# EAGLE design mini64se-F103-R6 (EAGLE 6.4)
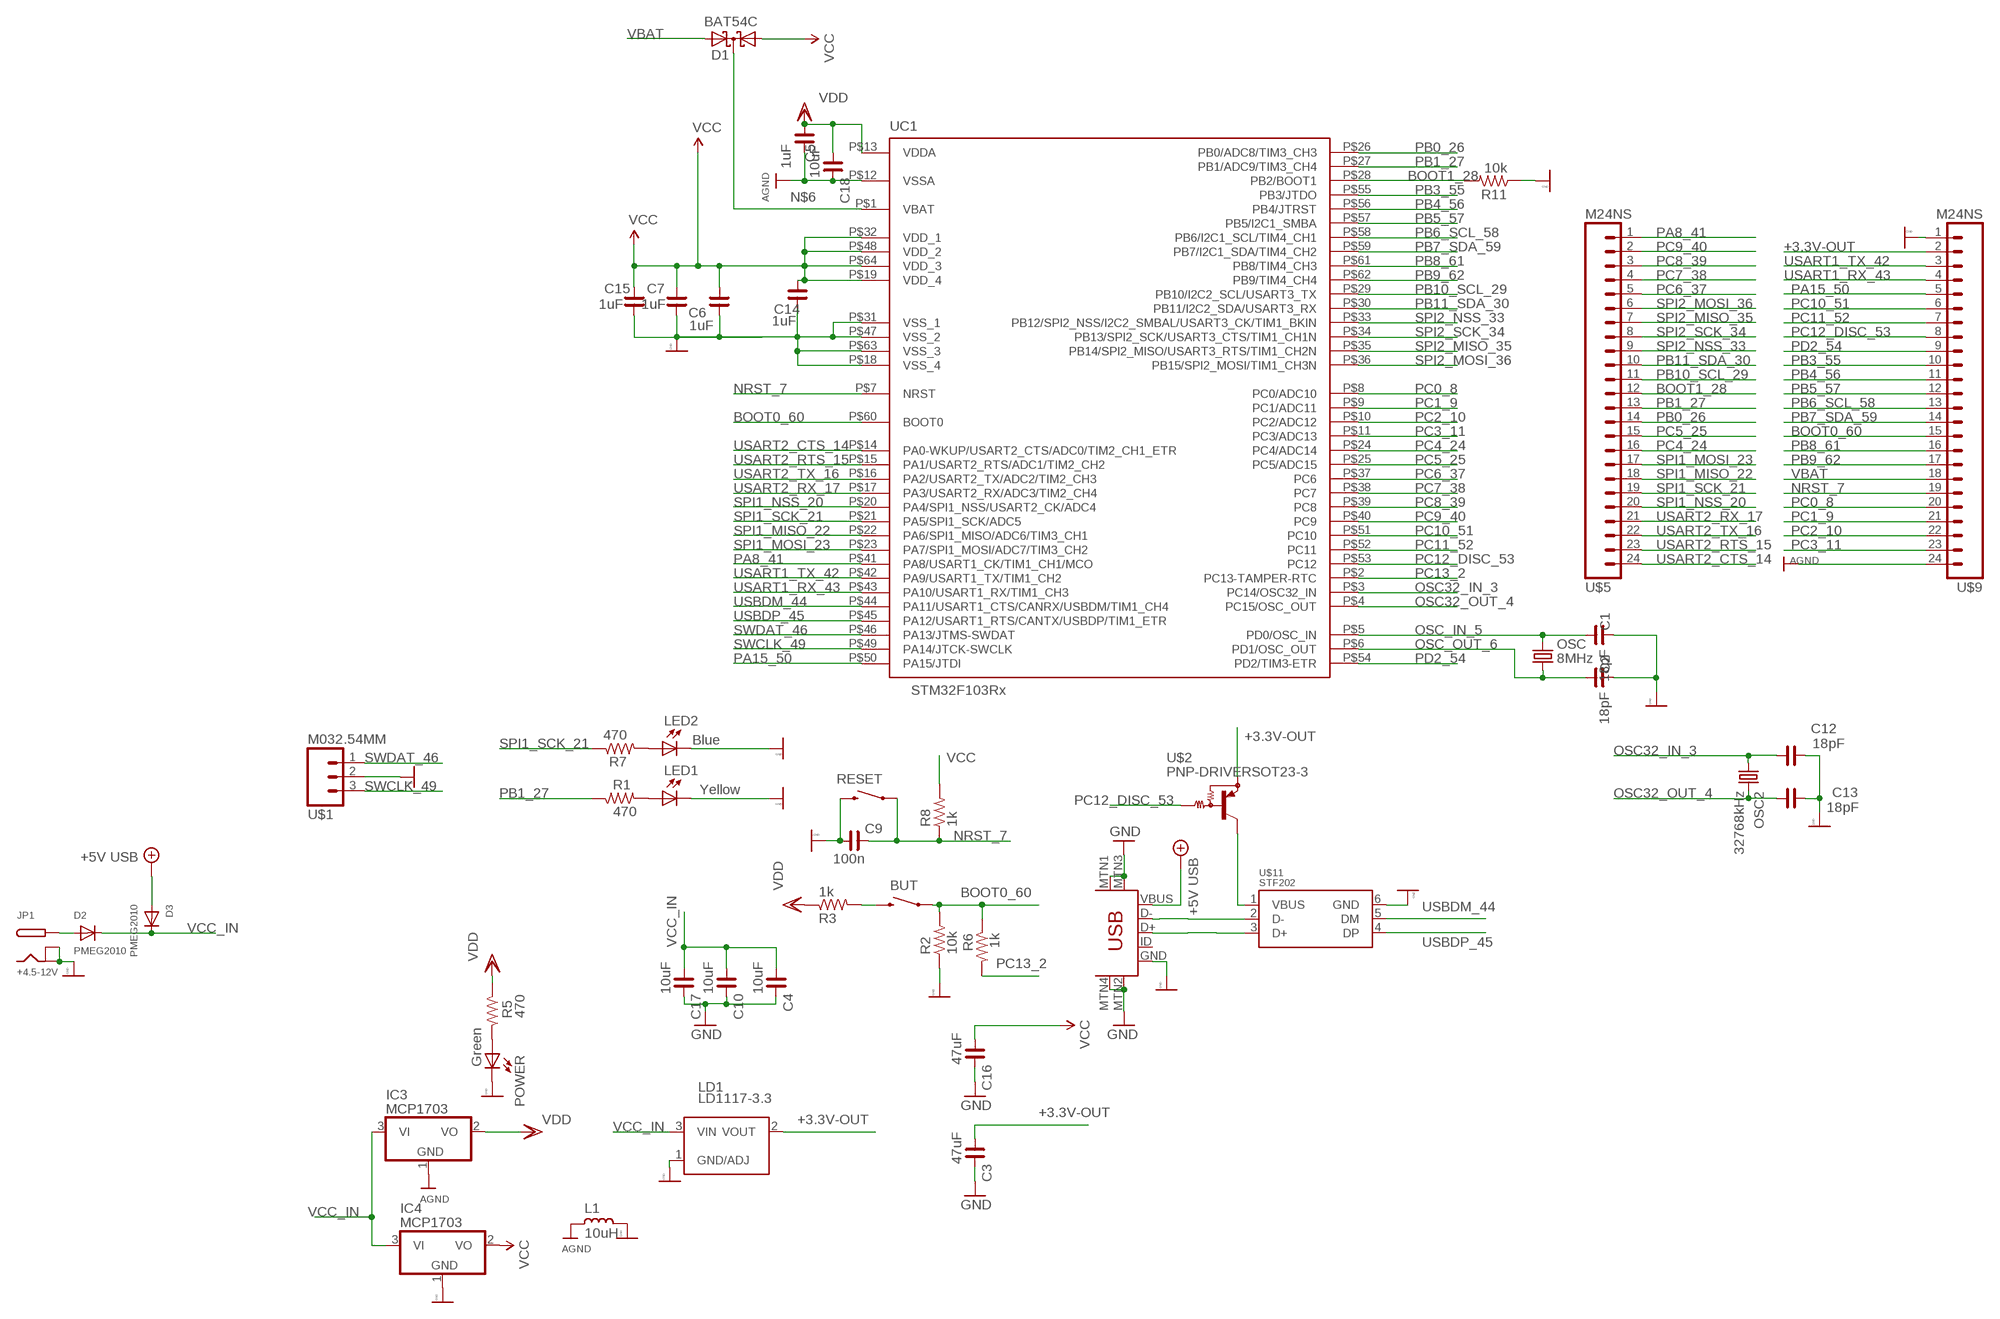
[diagram p0: schematic, sheet 1]

## Parts
BUT  SWITCH-MOMENTARY-2-N59  [TACTILE-SWITCH-N59]
C1  18pF  C_0603  [C0603]
C2  18pF  C_0603  [C0603]
C3  47uF  C_0805  [C0805]
C4  10uF  C_0603  [C0603]
C5  1uF  C_0603  [C0603]
C6  1uF  C_0603  [C0603]
C7  1uF  C_0603  [C0603]
C9  100n  C_0603  [C0603]
C10  10uF  C_0603  [C0603]
C12  18pF  C_0603  [C0603]
C13  18pF  C_0603  [C0603]
C14  1uF  C_0603  [C0603]
C15  1uF  C_0603  [C0603]
C16  47uF  C_0805  [C0805]
C17  10uF  C_0603  [C0603]
C18  10uF  C_0603  [C0603]
D1  BAT54C  BAT54CRS  [SOT23-3]
D2  PMEG2010  DIODESOD-323  [SOD-323]
D3  PMEG2010  DIODESOD-323  [SOD-323]
IC3  MCP1703  [SOT23-3]
IC4  MCP1703  [SOT23-3]
JP1  +4.5-12V  DCJACK  [DC-020-001]
L1  10uH  L_0603  [L0603]
LD1  LD1117-3.3  LD1117SOT223  [SOT223]
LED1  Yellow  LEDCHIP-LED0603  [CHIP-LED0603]
LED2  Blue  LEDCHIP-LED0603  [CHIP-LED0603]
OSC  8MHz  CRYSTALHC49UV  [HC49U-V]
OSC2  32768kHz  CRYSTALTC26HM  [TC26H-M]
POWER  Green  LEDCHIP-LED0603  [CHIP-LED0603]
R1  470  R_0603  [R0603]
R2  10k  R_0603  [R0603]
R3  1k  R_0603  [R0603]
R5  470  R_0603  [R0603]
R6  1k  R_0603  [R0603]
R7  470  R_0603  [R0603]
R8  1k  R_0603  [R0603]
R11  10k  R_0603  [R0603]
RESET  SWITCH-MOMENTARY-2-N59  [TACTILE-SWITCH-N59]
U$1  M032.54MM  M031X03_NO_SILK  [1X03_NO_SILK]
U$2  PNP-DRIVERSOT23-3  [SOT23-3]
U$5  M24NS  [1X24_NO_SILK]
U$9  M24NS  [1X24_NO_SILK]
U$11  STF202  STF202TSOP-6  [TSOP-6]
UC1  STM32F103Rx  STM32F103  [TQFP-10X10-64]
USB  USB-MINIB-5PIN  [USB-MINIB]

## Nets
+3.3V-OUT [vcc]: C3.1 LD1.2(VOUT) U$2.2(E) U$9.2
+5V [vcc]: D3.A USB.VBUS ; supply symbol labelled +5V USB
AGND [vcc]: C5.1 C18.2 IC3.1(GND) L1.2 U$9.24 UC1.P$12(VSSA)
BOOT0_60: BUT.P$1 R2.2 R6.1 U$9.15 UC1.P$60(BOOT0)
BOOT1_28: R11.2 U$5.12 UC1.P$28(PB2/BOOT1)
EXT_PWR [vcc]: D2.A JP1.PWR
GND [vcc]: C1.1 C2.1 C3.2 C4.2 C6.1 C7.1 C9.1 C10.2 C12.1 C13.1 C14.1 C15.1 C16.2 C17.2 IC4.1(GND) JP1.GND JP1.GNDBREAK L1.1 LD1.1(GND/ADJ) LED1.C LED2.C POWER.C R2.1 R11.1 RESET.P$2 U$1.2 U$9.1 U$11.6(GND) UC1.P$18(VSS_4) UC1.P$31(VSS_1) UC1.P$47(VSS_2) UC1.P$63(VSS_3) USB.GND USB.MTN1(MTN2) USB.MTN2(MTN3) USB.MTN3(MTN1) USB.MTN4
N$1: POWER.A R5.2
N$2: BUT.P$2 R3.2
N$3: LED2.A R7.2
N$4: LED1.A R1.1
N$6 [vcc]: D1.3(CC) UC1.P$1(VBAT)
N$11: U$2.3(C) U$11.1(VBUS)
N$14: U$11.2(D-) USB.D-
N$17: U$11.3(D+) USB.D+
NRST_7: C9.2 R8.1 RESET.P$1 U$9.19 UC1.P$7(NRST)
OSC32_IN_3: C12.2 OSC2.1 UC1.P$3(PC14/OSC32_IN)
OSC32_OUT_4: C13.2 OSC2.2 UC1.P$4(PC15/OSC_OUT)
OSC_IN_5: C1.2 OSC.2 UC1.P$5(PD0/OSC_IN)
OSC_OUT_6: C2.2 OSC.1 UC1.P$6(PD1/OSC_OUT)
PA8_41: U$5.1 UC1.P$41(PA8/USART1_CK/TIM1_CH1/MCO)
PA15_50: U$9.5 UC1.P$50(PA15/JTDI)
PB0_26: U$5.14 UC1.P$26(PB0/ADC8/TIM3_CH3)
PB1_27: R1.2 U$5.13 UC1.P$27(PB1/ADC9/TIM3_CH4)
PB3_55: U$9.10 UC1.P$55(PB3/JTDO)
PB4_56: U$9.11 UC1.P$56(PB4/JTRST)
PB5_57: U$9.12 UC1.P$57(PB5/I2C1_SMBA)
PB6_SCL_58: U$9.13 UC1.P$58(PB6/I2C1_SCL/TIM4_CH1)
PB7_SDA_59: U$9.14 UC1.P$59(PB7/I2C1_SDA/TIM4_CH2)
PB8_61: U$9.16 UC1.P$61(PB8/TIM4_CH3)
PB9_62: U$9.17 UC1.P$62(PB9/TIM4_CH4)
PB10_SCL_29: U$5.11 UC1.P$29(PB10/I2C2_SCL/USART3_TX)
PB11_SDA_30: U$5.10 UC1.P$30(PB11/I2C2_SDA/USART3_RX)
PC0_8: U$9.20 UC1.P$8(PC0/ADC10)
PC1_9: U$9.21 UC1.P$9(PC1/ADC11)
PC2_10: U$9.22 UC1.P$10(PC2/ADC12)
PC3_11: U$9.23 UC1.P$11(PC3/ADC13)
PC4_24: U$5.16 UC1.P$24(PC4/ADC14)
PC5_25: U$5.15 UC1.P$25(PC5/ADC15)
PC6_37: U$5.5 UC1.P$37(PC6)
PC7_38: U$5.4 UC1.P$38(PC7)
PC8_39: U$5.3 UC1.P$39(PC8)
PC9_40: U$5.2 UC1.P$40(PC9)
PC10_51: U$9.6 UC1.P$51(PC10)
PC11_52: U$9.7 UC1.P$52(PC11)
PC12_DISC_53: U$2.1(B) U$9.8 UC1.P$53(PC12)
PC13_2: R6.2 UC1.P$2(PC13-TAMPER-RTC)
PD2_54: U$9.9 UC1.P$54(PD2/TIM3-ETR)
SPI1_MISO_22: U$5.18 UC1.P$22(PA6/SPI1_MISO/ADC6/TIM3_CH1)
SPI1_MOSI_23: U$5.17 UC1.P$23(PA7/SPI1_MOSI/ADC7/TIM3_CH2)
SPI1_NSS_20: U$5.20 UC1.P$20(PA4/SPI1_NSS/USART2_CK/ADC4)
SPI1_SCK_21: R7.1 U$5.19 UC1.P$21(PA5/SPI1_SCK/ADC5)
SPI2_MISO_35: U$5.7 UC1.P$35(PB14/SPI2_MISO/USART3_RTS/TIM1_CH2N)
SPI2_MOSI_36: U$5.6 UC1.P$36(PB15/SPI2_MOSI/TIM1_CH3N)
SPI2_NSS_33: U$5.9 UC1.P$33(PB12/SPI2_NSS/I2C2_SMBAL/USART3_CK/TIM1_BKIN)
SPI2_SCK_34: U$5.8 UC1.P$34(PB13/SPI2_SCK/USART3_CTS/TIM1_CH1N)
SWCLK_49: U$1.3 UC1.P$49(PA14/JTCK-SWCLK)
SWDAT_46: U$1.1 UC1.P$46(PA13/JTMS-SWDAT)
USART1_RX_43: U$9.4 UC1.P$43(PA10/USART1_RX/TIM1_CH3)
USART1_TX_42: U$9.3 UC1.P$42(PA9/USART1_TX/TIM1_CH2)
USART2_CTS_14: U$5.24 UC1.P$14(PA0-WKUP/USART2_CTS/ADC0/TIM2_CH1_ETR)
USART2_RTS_15: U$5.23 UC1.P$15(PA1/USART2_RTS/ADC1/TIM2_CH2)
USART2_RX_17: U$5.21 UC1.P$17(PA3/USART2_RX/ADC3/TIM2_CH4)
USART2_TX_16: U$5.22 UC1.P$16(PA2/USART2_TX/ADC2/TIM2_CH3)
USBDM_44: U$11.5(DM) UC1.P$44(PA11/USART1_CTS/CANRX/USBDM/TIM1_CH4)
USBDP_45: U$11.4(DP) UC1.P$45(PA12/USART1_RTS/CANTX/USBDP/TIM1_ETR)
VBAT: D1.2(A2) U$9.18
VCC [vcc]: C6.2 C7.2 C14.2 C15.2 C16.1 D1.1(A1) IC4.2(VO) R8.2 UC1.P$19(VDD_4) UC1.P$32(VDD_1) UC1.P$48(VDD_2) UC1.P$64(VDD_3)
VCC_IN [vcc]: C4.1 C10.1 C17.1 D2.C D3.C IC3.3(VI) IC4.3(VI) LD1.3(VIN)
VDD [vcc]: C5.2 C18.1 IC3.2(VO) R3.1 R5.1 UC1.P$13(VDDA)
Unconnected: USB.ID

## Library data of the parts
BUT RESET = es:SWITCH-MOMENTARY-2
C1-C7 C9 C10 C12-C18 = rc-master-smd:C_: NON-POLARIZED CAP
D1 = es:BAT54C: Schottky Diodes Source: Fairchild .. BAT54.pdf
D2 D3 = es:DIODE: Diode SMADIODE - SMA Surface Mount Package 20V 1A Schottky Diode Digikey: 641-1014-6-ND DO-1N4148 - Through Hole Small Current Diode SOD-123 20V 1 A (.5mV Vf) Schottky Diode - Digikey: MBRX120TPMSCT-ND SOD-323 10V 570mA (.38mV Vf, 3ns) Schottky Diode - Digikey: ZLLS410CT-ND SOD-523 30V 30mA Schottky Diode (RB751S-40TE61) - Digikey: RB751S-40TE61CT-ND SOT23-R/W - SOT23 Package (R = Solder Paste/Reflow Ovens, W = Hand-Soldering) BAT54Film 40V 300mA - Digikey: 497-7162-1-ND
IC3 IC4 = es:MCP1703: 250 mA, 16V, Low Quiescent Current LDO Regulator Source: http://ww1.microchip.com/downloads/en/DeviceDoc/22049b.pdf
JP1 = es:DCJACK
L1 = rc-master-smd:L_: INDUCTOR
LD1 = es:LD1117
LED1 LED2 POWER = led:LED: LED OSRAM: - CHIPLED LG R971, LG N971, LY N971, LG Q971, LY Q971, LO R971, LY R971 LH N974, LH R974 LS Q976, LO Q976, LY Q976 LO Q996 - Hyper CHIPLED LW Q18S LB Q993, LB Q99A, LB R99A - SideLED LS A670, LO A670, LY A670, LG A670, LP A670 LB A673, LV A673, LT A673, LW A673 LH A674 LY A675 LS A676, LA A676, LO A676, LY A676, LW A676 LS A679, LY A679, LG A679 - Hyper Micro SIDELED® LS Y876, LA Y876, LO Y876, LY Y876 LT Y87S - SmartLED LW L88C, LW L88S LB L89C, LB L89S, LG L890 LS L89K, LO L89K, LY L89K LS L896, LA L896, LO L896, LY L896 - TOPLED LS T670, LO T670, LY T670, LG T670, LP T670 LSG T670, LSP T670, LSY T670, LOP T670, LYG T670 LG T671, LOG T671, LSG T671 LB T673, LV T673, LT T673, LW T673 LH T674 LS T676, LA T676, LO T676, LY T676, LB T676, LH T676, LSB T676, LW T676 LB T67C, LV T67C, LT T67C, LS T67K, LO T67K, LY T67K, LW E67C LS E67B, LA E67B, LO E67B, LY E67B, LB E67C, LV E67C, LT E67C LW T67C LS T679, LY T679, LG T679 LS T770, LO T770, LY T770, LG T770, LP T770 LB T773, LV T773, LT T773, LW T773 LH T774 LS E675, LA E675, LY E675, LS T675 LS T776, LA T776, LO T776, LY T776, LB T776 LHGB T686 LT T68C, LB T68C - Hyper Mini TOPLED® LB M676 - Mini TOPLED Santana® LG M470 LS M47K, LO M47K, LY M47K Source: http://www.osram.convergy.de LUXEON: - LUMILED® LXK2-PW12-R00, LXK2-PW12-S00, LXK2-PW14-U00, LXK2-PW14-V00 LXK2-PM12-R00, LXK2-PM12-S00, LXK2-PM14-U00 LXK2-PE12-Q00, LXK2-PE12-R00, LXK2-PE12-S00, LXK2-PE14-T00, LXK2-PE14-U00 LXK2-PB12-K00, LXK2-PB12-L00, LXK2-PB12-M00, LXK2-PB14-N00, LXK2-PB14-P00, LXK2-PB14-Q00 LXK2-PR12-L00, LXK2-PR12-M00, LXK2-PR14-Q00, LXK2-PR14-R00 LXK2-PD12-Q00, LXK2-PD12-R00, LXK2-PD12-S00 LXK2-PH12-R00, LXK2-PH12-S00 LXK2-PL12-P00, LXK2-PL12-Q00, LXK2-PL12-R00 Source: www.luxeon.com KINGBRIGHT: KA-3528ASYC Source: www.kingbright.com
OSC OSC2 = SparkFun_20110922_my:CRYSTAL: Crystals Various standard crystals. Proven footprints. Spark Fun Electronics SKU : COM-00534
R1-R3 R5-R8 R11 = rc-master-smd:R_: RESISTOR
U$1 = SparkFun_20110922_my:M03: Header 3 Standard 3-pin 0.1" header. Use with straight break away headers (SKU : PRT-00116), right angle break away headers (PRT-00553), swiss pins (PRT-00743), machine pins (PRT-00117), and female headers (PRT-00115). Molex polarized connector foot print use with SKU : PRT-08232 with associated crimp pins and housings.
U$2 = es:PNP-DRIVER
U$5 U$9 = SparkFun_20110922_my:M24
U$11 = es:STF202
UC1 = st-microelectronics:STM32F103
USB = SparkFun_20110922_my:USB-MINIB: Mini-USB "B" connector with 5th pin broken out. Created new symbol breaking out 5th "ID" pin in mini/micro USB connector spec. See: http://en.wikipedia.org/wiki/Mini_usb#Cables. Uses same footprint as 4-pin symbol. Also added pins to connect to mounting / shield pads if required (probably not generally needed as signals aren't shielded once they leave the connector).

## Net classes
1 vcc: width 0.15 mm

## Board
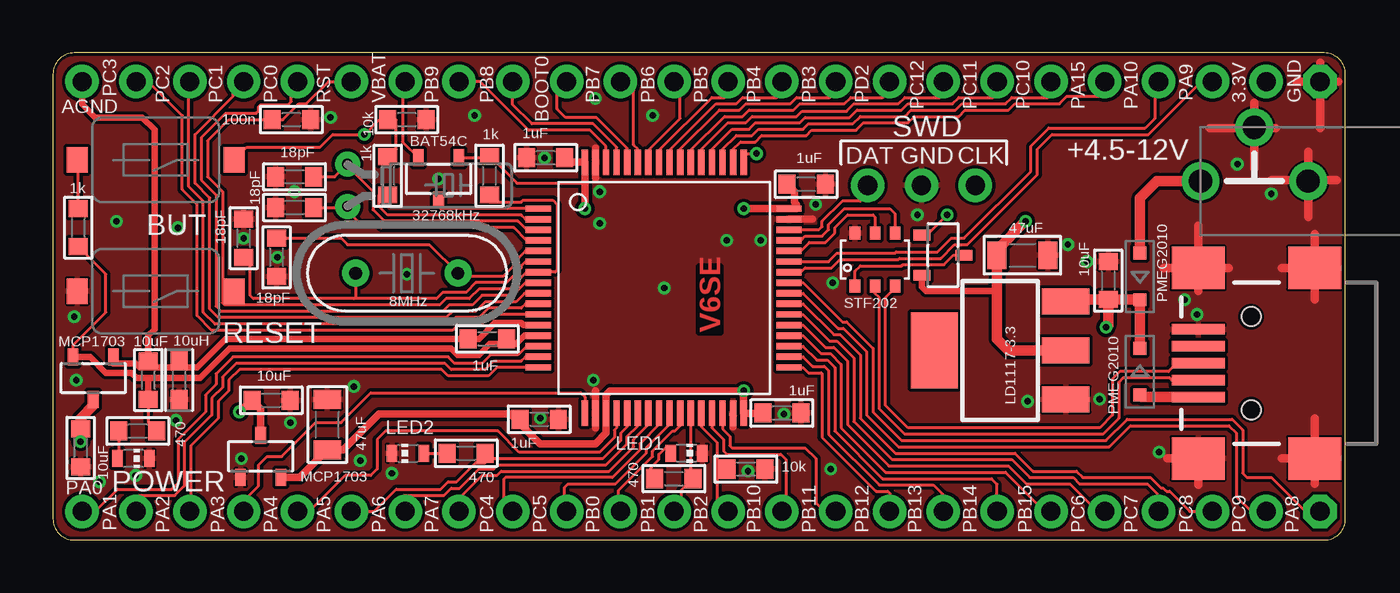
[diagram p1: board, top side]
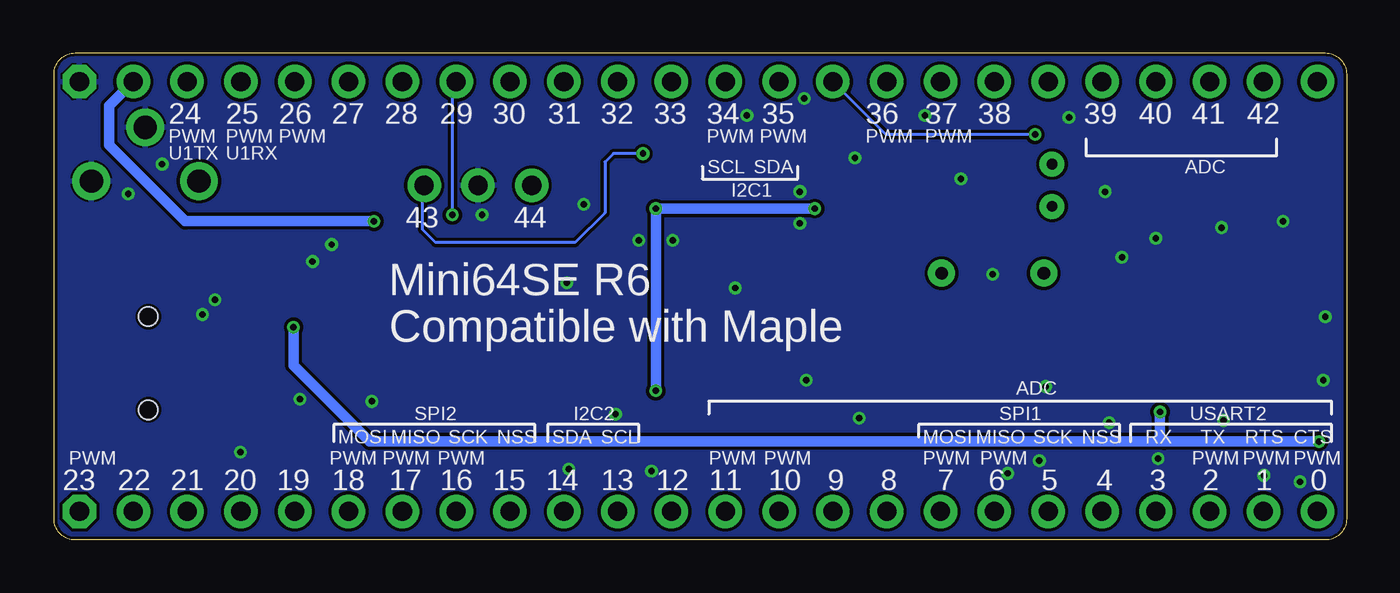
[diagram p2: board, bottom side, seen from below]

Size 61 x 23 mm. Coordinates in mm from the lower left corner, seen from the top.
Outline: 61,1 61,22 arc90 60,23 1,23 arc90 0,22 0,1 arc90 1,0 60,0 arc90 61,1
Copper layers (1*16): Top 0.018mm / dielectric 1.5mm / Bottom 0.018mm
Design rules "default *": minimum track width 0.15mm, minimum drill 0.3mm, track to track 0.15mm, track to pad 0.15mm, pad to pad 0.15mm, via to via 0.15mm, smd to smd 0.15mm, copper to edge 0.15mm, drill to drill 0.15mm, minimum pad ring 0.34mm, minimum via ring 0.15mm, stop-mask expansion 0mil, vias tented up to drill 25mil, thermal gap 0.1mm

### Footprints (pad centres in the part's own frame; a part is rotated, then mirrored left to right if it is on the bottom)
TACTILE-SWITCH-N59 = smd 1 x 1.2: P$1 -3.7,0; P$2 3.7,0
C0603 = smd 0.8 x 0.9: 1 -0.9,0; 2 0.9,0
C0805 = smd 0.9 x 1.3: 1 -1.2,0; 2 1.2,0
SOT23-3 = smd 0.5 x 0.8: 1 -0.95,-1; 2 0.95,-1; 3 0,1
SOD-323 = smd 0.6 x 0.6: A 1.1,0; C -1.1,0
DC-020-001 = drill 1.1: GND 0,-2.54; GNDBREAK 2.54,0; PWR 0,2.54
L0603 = smd 0.9 x 0.8: 1 -0.9,0; 2 0.9,0
SOT223 = smd 1.219 x 2.235: 1 -2.311,-3.099; 2 0,-3.099; 3 2.311,-3.099 | smd 3.6 x 2.2: 4 0,3.099
CHIP-LED0603 = smd 0.8 x 0.5: A 0,-0.75; C 0,0.75
HC49U-V = drill 0.6: 1 -2.413,0; 2 2.413,0
TC26H-M = drill 0.5: 1 -1,0; 2 1,0
R0603 = smd 0.8 x 0.9: 1 -0.9,0; 2 0.9,0
1X03_NO_SILK = drill 0.9: 1 0,0; 2 2.54,0; 3 5.08,0
1X24_NO_SILK = drill 0.9 octagon: 1 -29.2,0 | drill 0.9: 2 -26.66,0; 3 -24.12,0; 4 -21.58,0; 5 -19.04,0; 6 -16.5,0; 7 -13.96,0; 8 -11.42,0; 9 -8.88,0; 10 -6.34,0; 11 -3.8,0; 12 -1.26,0; 13 1.28,0; 14 3.82,0; 15 6.36,0; 16 8.9,0; 17 11.44,0; 18 13.98,0; 19 16.52,0; 20 19.06,0; 21 21.6,0; 22 24.14,0; 23 26.68,0; 24 29.22,0
TSOP-6 = smd 0.5 x 0.6: 1 -0.95,-1.25; 2 0,-1.25; 3 0.95,-1.25; 4 0.95,1.25; 5 0,1.25; 6 -0.95,1.25
TQFP-10X10-64 = smd 1.2 x 0.3: P$1 -5.936,3.75; P$2 -5.936,3.25; P$3 -5.936,2.75; P$4 -5.936,2.25; P$5 -5.936,1.75; P$6 -5.936,1.25; P$7 -5.936,0.75; P$8 -5.936,0.25; P$9 -5.936,-0.25; P$10 -5.936,-0.75; P$11 -5.936,-1.25; P$12 -5.936,-1.75; P$13 -5.936,-2.25; P$14 -5.936,-2.75; P$15 -5.936,-3.25; P$16 -5.936,-3.75; P$33 5.886,-3.75; P$34 5.886,-3.25; P$35 5.886,-2.75; P$36 5.886,-2.25; P$37 5.886,-1.75; P$38 5.886,-1.25; P$39 5.886,-0.75; P$40 5.886,-0.25; P$41 5.886,0.25; P$42 5.886,0.75; P$43 5.886,1.25; P$44 5.886,1.75; P$45 5.886,2.25; P$46 5.886,2.75; P$47 5.886,3.25; P$48 5.886,3.75 | smd 0.3 x 1.2: P$17 -3.75,-5.911; P$18 -3.25,-5.911; P$19 -2.75,-5.911; P$20 -2.25,-5.911; P$21 -1.75,-5.911; P$22 -1.25,-5.911; P$23 -0.75,-5.911; P$24 -0.25,-5.911; P$25 0.25,-5.911; P$26 0.75,-5.911; P$27 1.25,-5.911; P$28 1.75,-5.911; P$29 2.25,-5.911; P$30 2.75,-5.911; P$31 3.25,-5.911; P$32 3.75,-5.911; P$49 3.75,5.936; P$50 3.25,5.936; P$51 2.75,5.936; P$52 2.25,5.936; P$53 1.75,5.936; P$54 1.25,5.936; P$55 0.75,5.936; P$56 0.25,5.936; P$57 -0.25,5.936; P$58 -0.75,5.936; P$59 -1.25,5.936; P$60 -1.75,5.936; P$61 -2.25,5.936; P$62 -2.75,5.936; P$63 -3.25,5.936; P$64 -3.75,5.936
USB-MINIB = smd 2.5 x 0.5: D+ 2.5,0; D- 2.5,0.8; GND 2.5,-1.6; ID 2.5,-0.8; VBUS 2.5,1.6 | smd 2.5 x 2: MTN1 -3,4.5; MTN2 2.5,4.5; MTN3 -3,-4.5; MTN4 2.5,-4.5 | hole 0.9: 0,2.2; 0,-2.2

### Placement (x,y rotation side)
BUT  4.85,17.95 180 top
C1  10.55,13.35 90 top
C2  9,14.25 270 top
C3  45.75,13.45 0 top
C4  1.3,4.35 270 top
C5  20.5,9.5 0 top
C6  35.55,16.8 180 top
C7  34.4,6 180 top
C9  11.25,19.85 180 top
C10  10.3,6.6 0 top
C12  11.4,17.15 0 top
C13  11.4,15.7 0 top
C14  23.25,18.05 0 top
C15  22.95,5.7 180 top
C16  12.95,5.45 90 top
C17  49.8,12.25 90 top
C18  4.5,7.55 90 top
D1  18.2,17.05 180 top
D2  51.3,12.45 90 top
D3  51.3,7.95 270 top
IC3  1.9,7.65 180 top
IC4  9.8,3.95 0 top
JP1  56.7,16.95 90 top
L1  5.95,7.55 90 top
LD1  44.7,8.95 90 top
LED1  29.9,4.1 270 top
LED2  16.75,4.1 90 top
OSC  16.7,12.6 0 top
OSC2  13.9,16.75 270 top
POWER  3.8,3.85 270 top
R1  29.3,2.9 0 top
R2  16.7,19.85 180 top
R3  1.2,14.75 90 top
R5  4,5.15 180 top
R6  15.8,17.2 270 top
R7  19.5,4.1 180 top
R8  20.6,17.2 90 top
R11  32.7,3.35 180 top
RESET  4.85,11.75 180 top
U$1  38.45,16.75 0 top
U$2  42,13.45 270 top
U$5  30.6,1.35 180 top
U$9  30.6,21.65 180 top
U$11  38.8,13.25 0 top
UC1  28.85,11.9 0 top
USB  56.55,8.35 180 top

### Tracks (layer width: path | path; a pad name or v marks a point on that pad's centre or on a via)
+3.3V-OUT  (via drill 0.3)
  Top 0.3: U$2.2 41,11.95 41.2,11.75 44.55,11.75
  Top 0.5: LD1.2 45.1,8.95 44.55,9.5 44.55,11.75 C3.1 44.55,13.7 v45.9,15.05
  Bottom 0.5: v45.9,15.05 54.8,15.05 58.4,18.65 58.4,20.51 U$9.2
+5V
  Top 0.5: USB.VBUS 51.4,6.75 D3.A
AGND
  Top 0.3: UC1.P$12 22.2,10.15 22.1,10.25 20.85,10.25 20.1,9.5 C5.1 8.15,9.5 6.8,8.15 5.95,8.15 | IC3.1 2.85,8.35 3.9,8.35 4.1,8.15 4.5,8.15 | 4.5,8.15 5.95,8.15 | 4.5,8.15 C18.2 4.5,9.65 4.8,9.95 4.8,19.37 4.22,19.95 2,19.95 1.38,20.57 U$9.24 | L1.2 5.95,8.15
BOOT0_60  (via drill 0.3)
  Top 0.15: UC1.P$60 27.1,18.5 25.65,19.95 24.2,19.95 23.8,20.35 23.8,21.21 U$9.15 | BUT.P$1 9.15,18.55 12.6,18.55 13.2,19.15 v14.7,19.15 15.4,19.85 R2.2 16.2,19.85 16.2,18.45 15.85,18.1 R6.1
  Bottom 0.15: v14.7,19.15 21.74,19.15 U$9.15
BOOT1_28
  Top 0.15: UC1.P$28 30.6,5.35 31.35,4.6 31.35,3.35 | 31.35,3.35 31.35,1.86 U$5.12 | R11.2 31.35,3.35
EXT_PWR
  Top 0.5: JP1.PWR 52.1,16.95 51.3,16.15 D2.A
GND  (via drill 0.3)
  Top 0.35: 25.6,5.3 25.6,7.05 | 25.6,17.1 25.6,18.5 | 35.84,15.15 UC1.P$47 | UC1.P$31 32.1,5.35
  Top 0.4: 52.4,12.85 55.5,12.85 | 54.05,11.75 54.05,14.85 | 59.55,11.35 59.55,14.45 | 59.55,2.65 59.55,5.75 | 52.6,3.85 55.1,3.85 | 58,12.85 60.6,12.85 | 58,3.85 60.5,3.85 | 54.05,2.6 54.05,4.55 | 59.25,15.25 59.25,18.35 | 60.6,17 57.5,17 | 59.8,22.55 59.8,19.45 | 58.7,21.65 60.65,21.65 | 54.6,19.45 57.7,19.45 | 56.7,17.55 56.7,20.65
  other vias: 16.7,12.55 18.2,17.05 11.4,16.45 10.6,13.35 9,14.25 13.1,19.95 23.2,18.05 25.8,16.45 25.5,7.55 23,5.75 16,3.15 14.2,7.25 11.2,5.55 8.9,3.85 1,10.55 1.1,7.55 2.2,2.75 3.9,3.05 5.8,5.65 32.8,3.25 46,6.55 49.4,6.65 48.8,13.15 47.9,13.95 40.8,15.35 36,15.85 36.7,3.35 33.4,14.15 28.85,11.9 34.5,5.95 54,10.65 53.4,11.35 52.2,4.15 55.9,17.75 57.5,16.35 25.8,14.95 36.8,12.15 28.3,20.05 19.9,20.05 25.6,20.85 3,15.05 5.9,14.75 14.5,3.75 31.8,14.15
  pour Top: 0,23.05 0,-0.05 61,-0.05 61,23.05
  pour Bottom: 0,23.05 0,-0.05 61,-0.05 61,23.05
N$1
  Top 0.15: R5.2 3.1,3.9 POWER.A
N$2
  Top 0.15: R3.2 1.2,17.9 BUT.P$2
N$3
  Top 0.15: LED2.A R7.2
N$4
  Top 0.15: R1.1 28.4,2.95 28.1,3.25 28.1,3.3 28.6,3.8 28.6,4.05 28.9,4.35 LED1.A
N$6
  Top 0.15: UC1.P$1 18.3,15.65 18.2,15.75 D1.3
N$11
  Top 0.15: U$2.3 42.5,13.45 42.05,13 40.1,13 40.05,12.95 38.1,12.95 37.85,12.7 U$11.1
N$14
  Top 0.15: USB.D- 52.8,7.55 52.7,7.65 50.5,7.65 50.3,7.45 50.3,5.75 49.55,5 40.2,5 39,6.2 39,11.45 38.8,11.65 U$11.2
N$17
  Top 0.15: USB.D+ 53.05,8.35 52.65,7.95 50.35,7.95 50,7.6 50,5.9 49.4,5.3 40.35,5.3 39.3,6.35 39.3,11.45 39.8,11.95 U$11.3
NRST_7
  Top 0.15: 8.03,11.17 8,11.2 8,16.45 7.3,17.15 7.3,18.85 8.3,19.85 C9.2 10.85,19.85 11.6,20.6 11.95,20.6 13,21.65 U$9.19 | 8.03,11.17 8.1,11.1 18.25,11.1 18.55,11.4 19.65,11.4 20.1,11.85 21.55,11.85 22.35,12.65 UC1.P$7 23.7,12.65 23.8,12.75 23.8,15.85 23.6,16.05 22.2,16.05 22.1,15.95 20.6,15.95 R8.1 | RESET.P$1 8.55,11.7 8.03,11.17
OSC32_IN_3
  Top 0.15: UC1.P$3 22.35,14.65 21.95,15.05 15.65,15.05 15.1,15.6 15.1,16.45 13.9,17.65 OSC2.1 13.3,17.15 C12.2
OSC32_OUT_4
  Top 0.15: UC1.P$4 22.35,14.15 21.75,14.75 15.5,14.75 15.3,14.95 14.5,14.95 13.9,15.55 OSC2.2 13.85,15.7 C13.2
OSC_IN_5
  Top 0.15: UC1.P$5 22.3,13.65 21.8,13.15 21.8,13 21.25,12.45 19.26,12.45 OSC.2 17.76,13.95 13.9,13.95 13.6,14.25 C1.2
OSC_OUT_6
  Top 0.15: UC1.P$6 22.3,13.15 22.1,12.95 22.1,12.85 21.4,12.15 19.95,12.15 19.5,11.7 18.4,11.7 18.1,11.4 14.2,11.4 | 14.2,11.4 9.45,11.4 9.3,11.55 9.3,13.05 C2.2 | OSC.1 14.29,11.49 14.2,11.4
PA8_41
  Top 0.15: UC1.P$41 35.4,12.15 37.25,10.3 37.45,10.3 38.7,9.05 38.7,6.05 40.05,4.7 49.7,4.7 50.7,5.7 55.65,5.7 56.15,5.2 56.15,3.15 56.35,2.95 57.5,2.95 59.1,1.35 U$5.1
PA15_50
  Top 0.15: UC1.P$50 32.1,18.45 32.45,18.8 33.15,18.8 33.45,19.1 35.55,19.1 35.8,19.35 37.9,19.35 38.25,19.7 40.35,19.7 40.65,20 42.75,20 43.05,20.3 45.1,20.3 45.4,20.6 47.5,20.6 47.85,20.95 49.5,20.95 49.6,21.05 49.6,21.61 U$9.5
PB0_26
  Top 0.15: UC1.P$26 29.6,5.4 29.35,5.15 29.25,5.15 28.3,4.2 28.3,3.95 26.7,2.35 26.7,1.35 U$5.14
PB1_27
  Top 0.15: U$5.13 29.65,1.68 29.65,2.35 R1.2 30.1,3 UC1.P$27
PB3_55
  Top 0.15: UC1.P$55 29.6,18.45 31.45,20.3 32.4,20.3 32.7,20.6 34.8,20.6 35.1,20.9 36.65,20.9 36.7,20.95 36.7,21.65 U$9.10
PB4_56
  Top 0.15: UC1.P$56 29.1,18.4 31.3,20.6 32.25,20.6 32.55,20.9 34.15,20.9 34.2,20.95 34.2,21.65 U$9.11
PB5_57
  Top 0.15: UC1.P$57 28.6,18.4 31.1,20.9 31.7,20.9 31.9,21.1 31.9,21.61 U$9.12
PB6_SCL_58
  Top 0.15: UC1.P$58 28.1,18.4 29.6,19.9 29.6,21.37 U$9.13
PB7_SDA_59
  Top 0.15: UC1.P$59 27.6,18.45 27.4,18.65 27.4,21.23 26.98,21.65 U$9.14
PB8_61
  Top 0.15: UC1.P$61 26.6,18.55 25.5,19.65 22.6,19.65 21.7,20.55 U$9.16
PB9_62
  Top 0.15: UC1.P$62 26.1,18.6 25.35,19.35 22.45,19.35 20.15,21.65 U$9.17
PB10_SCL_29
  Top 0.15: UC1.P$29 31.1,5.3 31.65,4.75 31.65,4.2 31.8,4.05 34.35,4.05 34.6,3.8 34.6,1.45 34.5,1.35 U$5.11
PB11_SDA_30
  Top 0.15: UC1.P$30 31.6,5.25 31.95,4.9 31.95,4.45 32.05,4.35 35.5,4.35 36,3.85 36,1.75 36.4,1.35 U$5.10
PC0_8
  Top 0.15: UC1.P$8 22.3,12.15 21.7,11.55 20.25,11.55 19.8,11.1 18.7,11.1 18.4,10.8 7.95,10.8 7.7,11.05 7.7,16.3 7,17 7,19 8.15,20.15 9.6,20.15 9.7,20.25 9.7,20.45 9.8,20.55 11.1,20.55 11.25,20.7 11.25,21.65 U$9.20
PC1_9
  Top 0.15: UC1.P$9 22.25,11.65 21.85,11.25 20.4,11.25 19.95,10.8 18.85,10.8 18.55,10.5 7.8,10.5 7.4,10.9 7.4,16.15 6.7,16.85 6.7,19.15 8.5,20.95 8.5,21.65 U$9.21
PC2_10
  Top 0.15: UC1.P$10 22.3,11.15 22.1,10.95 20.55,10.95 20.1,10.5 19,10.5 18.7,10.2 7.65,10.2 7.1,10.75 7.1,16 6.4,16.7 6.4,21.65 U$9.22
PC3_11
  Top 0.15: UC1.P$11 20.7,10.65 20.25,10.2 19.15,10.2 18.85,9.9 7.5,9.9 6.8,10.6 6.8,15.85 6.1,16.55 6.1,20.05 4.5,21.65 U$9.23
PC4_24
  Top 0.15: UC1.P$24 28.6,5.45 27.7,4.55 27.7,4.25 26.4,2.95 21.35,2.95 21.3,2.9 21.3,1.35 U$5.16
PC5_25
  Top 0.15: UC1.P$25 29.1,5.45 28,4.35 28,4.1 26.55,2.65 24.3,2.65 24.15,2.5 24.15,1.35 U$5.15
PC6_37
  Top 0.15: UC1.P$37 35.4,10.15 36.45,9.1 36.85,9.1 37.5,8.45 37.5,5.45 39.45,3.5 45.1,3.5 45.95,2.65 48,2.65 49.3,1.35 U$5.5
PC7_38
  Top 0.15: UC1.P$38 35.4,10.65 36.65,9.4 37,9.4 37.8,8.6 37.8,5.6 39.6,3.8 45.25,3.8 46.1,2.95 48.15,2.95 48.45,2.65 51.65,2.65 52.1,2.2 52.1,1.43 U$5.4
PC8_39
  Top 0.15: UC1.P$39 35.4,11.15 36.85,9.7 37.15,9.7 38.1,8.75 38.1,5.75 39.75,4.1 45.4,4.1 46.25,3.25 48.3,3.25 48.6,2.95 51.8,2.95 52.3,2.45 52.4,2.45 52.55,2.3 52.7,2.3 53.65,1.35 U$5.3
PC9_40
  Top 0.15: UC1.P$40 35.4,11.65 37.05,10 37.3,10 38.4,8.9 38.4,5.9 39.9,4.4 49.85,4.4 50.85,5.4 55.5,5.4 55.85,5.05 55.85,2.05 56.55,1.35 U$5.2
PC10_51
  Top 0.15: UC1.P$51 31.6,18.45 32.25,19.1 33,19.1 33.3,19.4 35.4,19.4 35.65,19.65 37.75,19.65 38.1,20 40.2,20 40.5,20.3 42.6,20.3 42.9,20.6 44.95,20.6 45.25,20.9 46.95,20.9 47.1,21.05 U$9.6
PC11_52
  Top 0.15: UC1.P$52 31.1,18.45 32.05,19.4 32.85,19.4 33.15,19.7 35.25,19.7 35.5,19.95 37.6,19.95 37.95,20.3 40.05,20.3 40.35,20.6 42.45,20.6 42.75,20.9 44.35,20.9 44.5,21.05 44.5,21.59 U$9.7
PC12_DISC_53  (via drill 0.3)
  Top 0.15: U$2.1 41,14.45 41.3,14.45 v42.2,15.35 | UC1.P$53 30.6,18.45 31.85,19.7 32.7,19.7 33,20 35.1,20 35.35,20.25 37.45,20.25 37.8,20.6 39.9,20.6 40.2,20.9 41.85,20.9 42,21.05 42,21.63 U$9.8
  Bottom 0.15: v42.2,15.35 42.2,21.47 U$9.8
PC13_2
  Top 0.15: UC1.P$2 22.3,15.15 22.1,15.35 15.8,15.35 15.4,15.75 15.4,16.3 R6.2
PD2_54
  Top 0.15: UC1.P$54 30.1,18.4 31.7,20 32.55,20 32.85,20.3 34.95,20.3 35.25,20.6 37.35,20.6 37.65,20.9 39.15,20.9 39.3,21.05 39.3,21.65 U$9.9
SPI1_MISO_22
  Top 0.15: UC1.P$22 27.6,5.4 27.1,4.9 27.1,4.55 26.1,3.55 21,3.55 20.8,3.35 20.1,3.35 19.2,2.45 18.8,2.45 18.45,2.1 16.55,2.1 16.4,1.95 16.4,1.35 U$5.18
SPI1_MOSI_23
  Top 0.15: UC1.P$23 28.1,5.45 27.4,4.75 27.4,4.4 26.25,3.25 21.15,3.25 20.95,3.05 20.25,3.05 19,1.8 19,1.35 U$5.17
SPI1_NSS_20
  Top 0.15: UC1.P$20 26.6,5.3 26.5,5.2 26.5,4.85 25.8,4.15 22,4.15 21,5.15 15.7,5.15 15.3,4.75 15.3,3.35 15,3.05 13.8,3.05 12.1,1.35 U$5.20
SPI1_SCK_21
  Top 0.15: UC1.P$21 27.1,5.35 26.8,5.05 26.8,4.7 25.95,3.85 20.4,3.85 | U$5.19 15.15,1.35 16.2,2.4 18.3,2.4 18.65,2.75 19.05,2.75 19.95,3.65 20.4,3.65 20.4,3.85 | R7.1 20.4,3.85
SPI2_MISO_35
  Top 0.15: UC1.P$35 35.4,9.15 36.05,8.5 36.55,8.5 36.9,8.15 36.9,5.15 39.15,2.9 44.3,2.9 44.56,2.64 U$5.7
SPI2_MOSI_36
  Top 0.15: UC1.P$36 35.4,9.65 36.25,8.8 36.7,8.8 37.2,8.3 37.2,5.3 39.3,3.2 44.95,3.2 46.8,1.35 U$5.6
SPI2_NSS_33
  Top 0.15: UC1.P$33 35.4,8.15 35.65,7.9 36.25,7.9 36.3,7.85 36.3,4.85 38.85,2.3 39.4,2.3 39.5,2.2 39.5,1.37 U$5.9 39.6,1.35
SPI2_SCK_34
  Top 0.15: UC1.P$34 35.4,8.65 35.85,8.2 36.4,8.2 36.6,8 36.6,5 39,2.6 41.55,2.6 42,2.15 42,1.37 U$5.8
SWCLK_49  (via drill 0.3)
  Top 0.15: v33.2,18.25 32.6,18.25 UC1.P$49
  Bottom 0.15: v33.2,18.25 34.6,18.25 35,17.85 35,15.45 36.4,14.05 43,14.05 43.6,14.65 43.6,16.68 U$1.3
SWDAT_46
  Top 0.15: UC1.P$46 36.15,14.65 36.3,14.8 36.3,15.05 37.25,16 38.1,16 38.45,16.35 U$1.1
USART1_RX_43
  Top 0.15: UC1.P$43 36.6,13.15 37,13.55 39.75,13.55 39.8,13.6 41.75,13.6 42.4,14.25 43,14.25 46.15,17.4 46.15,18.6 47,19.45 51.55,19.45 52,19.9 52,21.65 U$9.4
USART1_TX_42
  Top 0.15: UC1.P$42 35.3,12.65 35.5,12.85 36.75,12.85 37.15,13.25 39.9,13.25 39.95,13.3 41.9,13.3 42.55,13.95 43.15,13.95 46.45,17.25 46.45,18.45 47.15,19.15 51.7,19.15 54.2,21.65 U$9.3
USART2_CTS_14
  Top 0.15: UC1.P$14 22.35,9.15 21.95,8.75 20.65,8.75 20.25,8.35 18.95,8.35 18.65,8.65 8.5,8.65 7.7,7.85 7.7,7.35 7.2,6.85 7.2,6.05 5.9,4.75 5.9,2.7 5.6,2.4 3.05,2.4 2.02,1.37 1.4,1.37 U$5.24
USART2_RTS_15
  Top 0.15: UC1.P$15 22.3,8.65 22.1,8.45 20.8,8.45 20.4,8.05 18.8,8.05 18.5,8.35 8.65,8.35 8,7.7 8,7.2 7.5,6.7 7.5,5.9 6.2,4.6 6.2,2.55 5.75,2.1 4.05,2.1 3.95,2 3.95,1.35 U$5.23
USART2_RX_17
  Top 0.15: UC1.P$17 25.1,6.75 24.9,6.95 15,6.95 13.6,5.55 12.4,5.55 10.8,3.95 10.1,3.95 9.7,3.55 9.7,2.55 9,1.85 U$5.21
USART2_TX_16
  Top 0.15: UC1.P$16 20.95,8.15 20.55,7.75 18.65,7.75 18.35,8.05 8.8,8.05 8.3,7.55 8.3,7.05 7.8,6.55 7.8,5.75 6.5,4.45 6.5,1.35 U$5.22
USBDM_44
  Top 0.15: UC1.P$44 35.3,13.65 35.7,14.05 36.45,14.05 36.9,14.5 36.9,14.75 37.5,15.35 38.7,15.35 38.8,15.25 U$11.5
USBDP_45
  Top 0.15: UC1.P$45 35.3,14.15 35.5,14.35 36.3,14.35 36.6,14.65 36.6,14.9 37.35,15.65 39.5,15.65 39.75,15.4 U$11.4
VBAT
  Top 0.15: U$9.18 16.5,21.65 16.5,18.8 D1.2
VCC  (via drill 0.3)
  Top 0.15: 25.1,16.85 21.9,16.85 20.65,18.1 R8.2 20.55,18.05 D1.1
  Top 0.35: 21.8,5.75 21.6,5.95 15.4,5.95 13.7,4.25 C16.1 11.65,2.95 IC4.2 | 21.8,5.75 23,4.55 25.6,4.55 26.1,5.05 UC1.P$19 26.1,6.85 26.3,7.05 v32.6,7.05 UC1.P$32 33.49,5.99 C7.2 | v32.6,15.65 UC1.P$48 35.1,15.65 35.1,15.85 35,15.95 35,16.45 C6.2 | v25.1,15.65 25.1,16.85 UC1.P$64 24.36,17.84 C14.2 | 21.8,5.75 22,5.75 C15.2
  Bottom 0.5: v32.6,7.05 v32.6,15.65 v25.1,15.65
VCC_IN  (via drill 0.3)
  Top 0.35: v8.8,6.05 9.35,6.6 C10.1 9.8,6.2 IC4.3
  Top 0.5: LD1.3 48.3,11.26 | 48.15,11.41 48.3,11.26 | IC3.3 1.9,6.35 1.3,5.75 C4.1 v1.3,4.65 | D3.C D2.C C17.1 | C17.1 48.39,11.35 48.3,11.26 | C17.1 49.8,10.15 v49.7,10.05
  Bottom 0.5: v1.3,4.65 8.6,4.65 | 8.6,4.65 46.1,4.65 49.7,8.25 v49.7,10.05 | v8.8,6.05 8.8,4.85 8.6,4.65
VDD
  Top 0.15: IC3.2 0.95,9.2 2.5,10.75 2.5,12.55 R3.1 | C18.1 4.5,5.55 R5.1
  Top 0.3: UC1.P$13 22.25,9.65 21.85,9.25 21.4,9.25 | 21.4,9.25 20.6,9.25 20.1,8.75 19.1,8.75 18.8,9.05 8.35,9.05 6.95,7.65 4.5,7.65 | C5.2 21.4,9.25 | IC3.2 1.75,8.65 2.5,7.9 3.7,7.9 3.95,7.65 4.5,7.65 | C18.1 4.5,7.65
(copper drawn outside any net)
  shapes: Top circle x2

### Text on the board
Top: V6SE
tPlace: SWD | DAT | GND | CLK
bPlace: 42 | 41 | 40 | 39 | 38 | 37 | 36 | 35 | 34 | 33 | 32 | 31 | 30 | 29 | 28 | 27 | 26 | 25 | 24 | PWM | PWM | PWM | PWM | PWM | PWM | PWM | ADC | SDA | SCL | U1RX | U1TX | I2C1 | 44 | 43 | Mini64SE R6 | Compatible with Maple | ADC | USART2 | SPI1 | I2C2 | SPI2 | CTS | RTS | TX | RX | NSS | SCK | MISO | MOSI | SCL | SDA | NSS | SCK | MISO | MOSI | PWM | PWM | PWM | PWM | PWM | PWM | PWM | PWM | PWM | PWM | PWM | 0 | 1 | 2 | 3 | 4 | 5 | 6 | 7 | 8 | 9 | 10 | 11 | 12 | 13 | 14 | 15 | 16 | 17 | 18 | 19 | 20 | 21 | 22 | 23
tNames: PC3 | PC2 | PC1 | PC0 | RST | VBAT | PB9 | PB8 | PB7 | PB6 | PB5 | PB4 | PB3 | PD2 | PA9 | 3.3V | GND | AGND | BOOT0 | PC12 | PC11 | PC10 | PA15 | PA10 | PA0 | PA1 | PA2 | PA3 | PA4 | PA5 | PA6 | PA7 | PC4 | PC5 | PB0 | PB1 | PB2 | PB10 | PB11 | PB12 | PB13 | PB14 | PB15 | PC6 | PC7 | PC8 | PC9 | PA8